# EAGLE design MiP D1 mini Pack v1 (EAGLE 7.7.0)
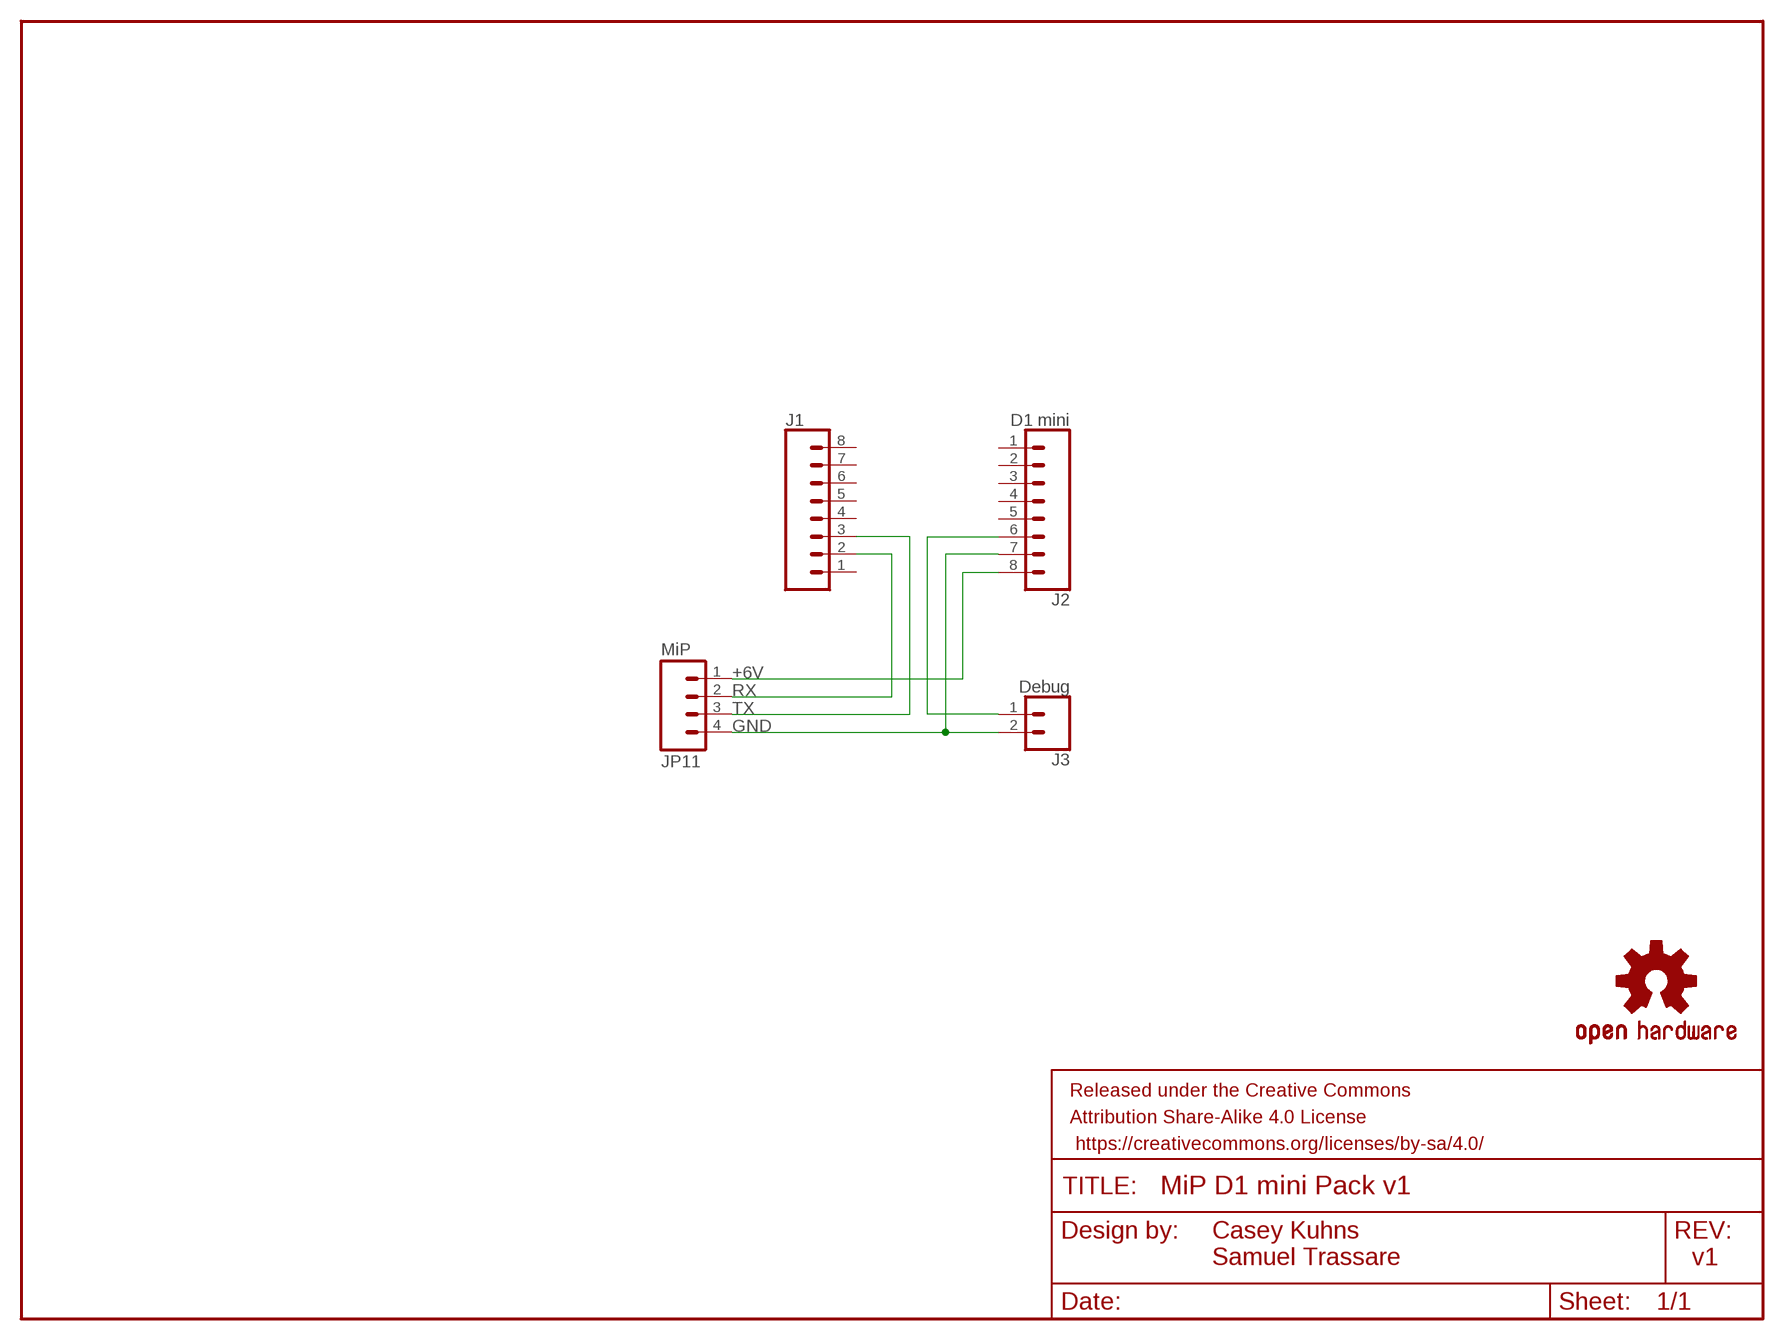
[diagram p0: schematic, sheet 1]

## Parts
FRAME1  FRAME-LETTER  [CREATIVE_COMMONS]
J1  CONN_08"  [1X08]
J2  D1 mini  CONN_08"  [1X08]
J3  Debug  CONN_02PTH_RA_FEMALE  [1X02_RA_PTH_FEMALE]
JP11  MiP  M04JST  [1X04-1.5MM_JST]
LOGO2  OSHW-LOGOS  [OSHW-LOGO-S]

## Nets
+6V [vcc]: J2.8 JP11.1
GND [ground]: J2.7 J3.2 JP11.4
N$4: J2.6 J3.1
RX: J1.2 JP11.2
TX: J1.3 JP11.3
Unconnected: J1.1 J1.4 J1.5 J1.6 J1.7 J1.8 J2.1 J2.2 J2.3 J2.4 J2.5

## Notes on the sheet
- Casey Kuhns
  Samuel Trassare
- v1

## Library data of the parts
FRAME1 = SparkFun-Aesthetics:FRAME-LETTER: Schematic Frame Standard 8.5x11 US Letter frame
J1 J2 = SparkFun-Connectors:CONN_08: Multi connection point. Often used as Generic Header-pin footprint for 0.1 inch spaced/style header connections On any of the 0.1 inch spaced packages, you can populate with these: Break Away Headers - Straight <https://www.sparkfun.com/products/116> (PRT-00116) Break Away Male Headers - Right Angle <https://www.sparkfun.com/products/553> (PRT-00553) Female Headers <https://www.sparkfun.com/products/115> (PRT-00115) Break Away Headers - Machine Pin <https://www.sparkfun.com/products/117> (PRT-00117) Break Away Female Headers - Swiss Machine Pin <https://www.sparkfun.com/products/743> (PRT-00743) Arduino Stackable Header - 8 Pin <https://www.sparkfun.com/products/9279> (PRT-09279) For SCREWTERMINALS and SPRING TERMINALS visit here: Screw Terimnals on SparkFun.com <https://www.sparkfun.com/search/results?term=Screw+Terminals> (5mm/3.5mm/2.54mm spacing) This device is also useful as a general connection point to wire up your design to another part of your project. Our various solder wires solder well into these plated through hole pads. Hook-Up Wire - Assortment (Stranded, 22 AWG) <https://www.sparkfun.com/products/11375> (PRT-11375) Hook-Up Wire - Assortment (Solid Core, 22 AWG) <https://www.sparkfun.com/products/11367> (PRT-11367) View the entire wire category on our website here <https://www.sparkfun.com/categories/141> Special notes: Molex polarized connector foot print use with SKU : PRT-08231 with associated crimp pins and housings. 1MM SMD Version SKU: PRT-10208 NOTES ON THE VARIANTS LOCK and LOCK_LONGPADS... This footprint was designed to help hold the alignment of a through-hole component (i.e. 6-pin header) while soldering it into place. You may notice that each hole has been shifted either up or down by 0.005 of an inch from it's more standard position (which is a perfectly straight line). This slight alteration caused the pins (the squares in the middle) to touch the edges of the holes. Because they are alternating, it causes a "brace" to hold the component in place. 0.005 has proven to be the perfect amount of "off-center" position when using our standard breakaway headers. Although looks a little odd when you look at the bare footprint, once you have a header in there, the alteration is very hard to notice. Also,if you push a header all the way into place, it is covered up entirely on the bottom side.; PROD_ID: CONN-08438
J3 = SparkFun-Connectors:CONN_02: Multi connection point. Often used as Generic Header-pin footprint for 0.1 inch spaced/style header connections On any of the 0.1 inch spaced packages, you can populate with these: Break Away Headers - Straight <https://www.sparkfun.com/products/116> (PRT-00116) Break Away Male Headers - Right Angle <https://www.sparkfun.com/products/553> (PRT-00553) Female Headers <https://www.sparkfun.com/products/115> (PRT-00115) Break Away Headers - Machine Pin <https://www.sparkfun.com/products/117> (PRT-00117) Break Away Female Headers - Swiss Machine Pin <https://www.sparkfun.com/products/743> (PRT-00743) For SCREWTERMINALS and SPRING TERMINALS visit here: Screw Terimnals on SparkFun.com <https://www.sparkfun.com/search/results?term=Screw+Terminals> (5mm/3.5mm/2.54mm spacing) This device is also useful as a general connection point to wire up your design to another part of your project. Our various solder wires solder well into these plated through hole pads. Hook-Up Wire - Assortment (Stranded, 22 AWG) <https://www.sparkfun.com/products/11375> (PRT-11375) Hook-Up Wire - Assortment (Solid Core, 22 AWG) <https://www.sparkfun.com/products/11367> (PRT-11367) View the entire wire category on our website here <https://www.sparkfun.com/categories/141> Special notes: Molex polarized connector foot print use with: PRT-08233 with associated crimp pins and housings. 2.54_SCREWTERM for use with PRT-10571. 3.5mm Screw Terminal footprints for PRT-08084 5mm Screw Terminal footprints for use with PRT-08432; PROD_ID: CONN-13700
JP11 = SparkFun-Connectors:M04: Header 4 Standard 4-pin 0.1" header. Use with straight break away headers (SKU : PRT-00116), right angle break away headers (PRT-00553), swiss pins (PRT-00743), machine pins (PRT-00117), and female headers (PRT-00115). Molex polarized connector foot print use with SKU : PRT-08231 with associated crimp pins and housings. 1MM SMD Version SKU: PRT-10208
LOGO2 = SparkFun-Aesthetics:OSHW-LOGO: Open Source Hardware Logo This logo indicates the piece of hardware it is found on incorporates a OSHW license and/or adheres to the definition of open source hardware found here: http://freedomdefined.org/OSHW

## Net classes
0 default: width 0.406 mm
1 vcc: width 0.61 mm
2 ground: width 0.61 mm

## Board
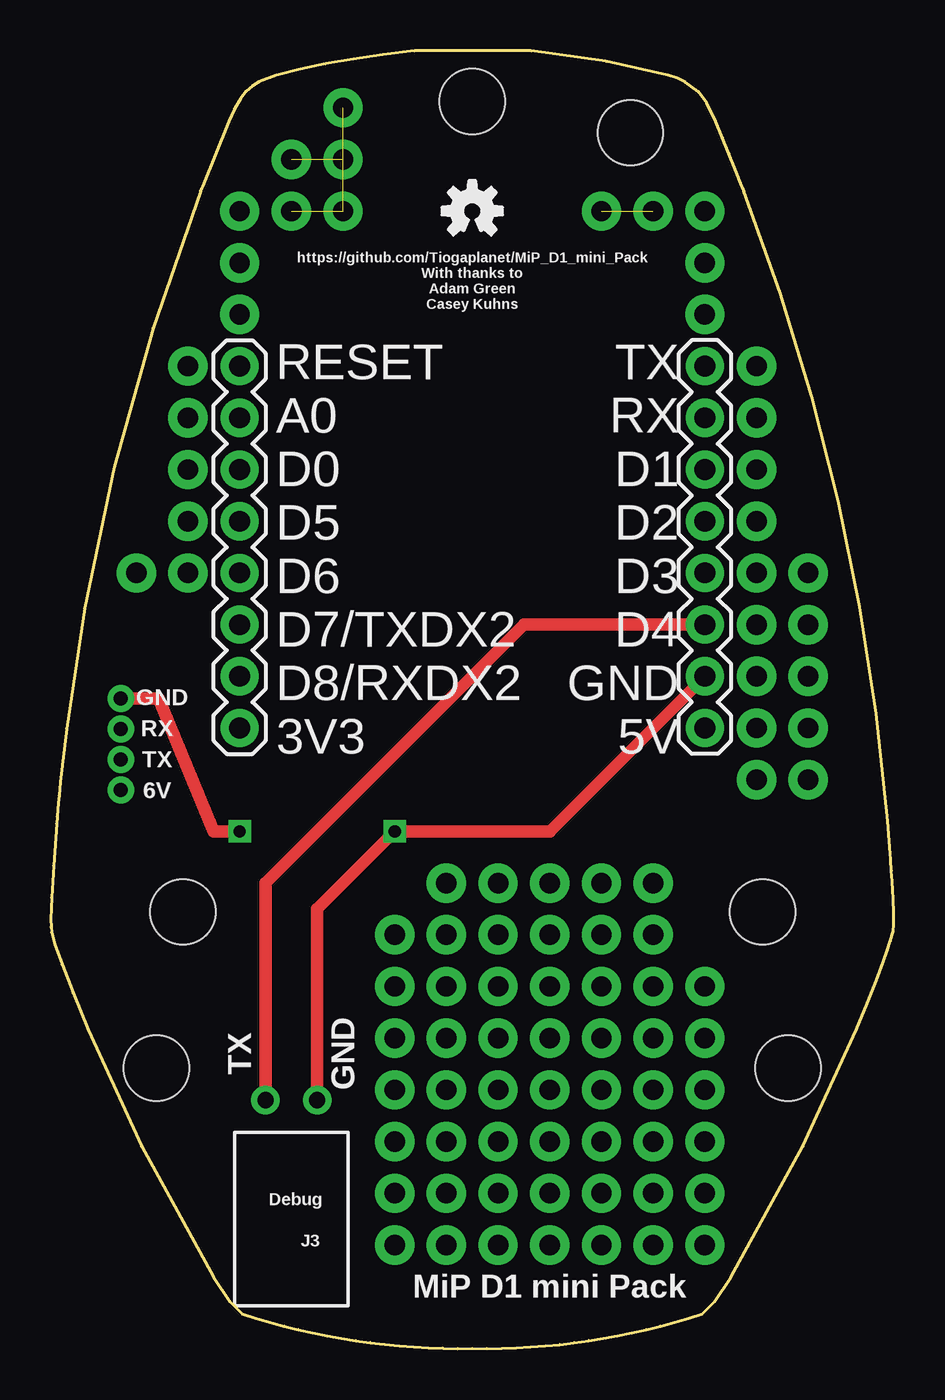
[diagram p1: board, top side]
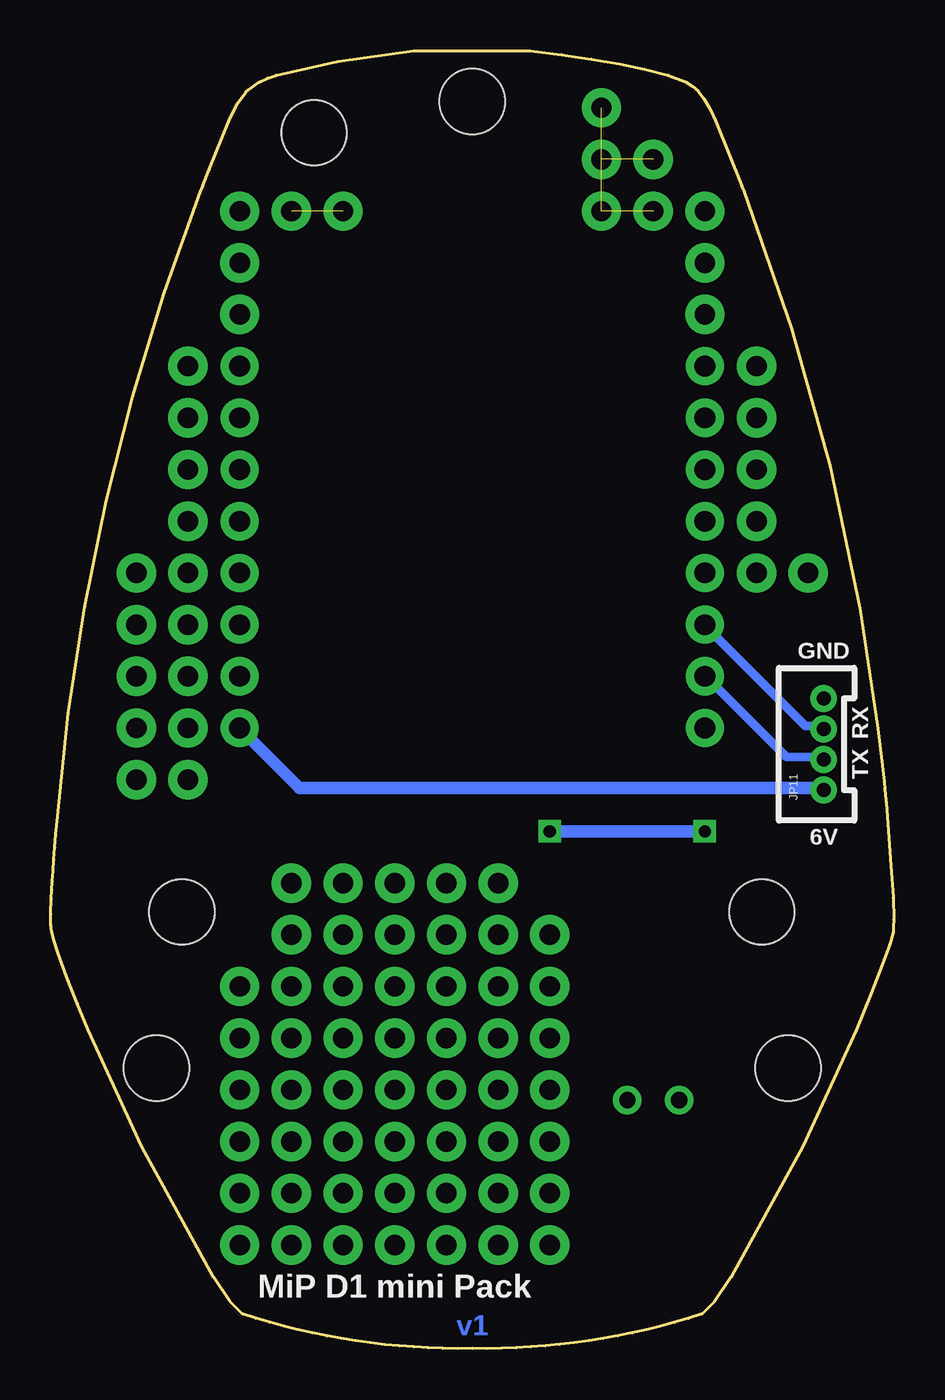
[diagram p2: board, bottom side, seen from below]

Size 41.42 x 63.77 mm. Coordinates in mm from the lower left corner, seen from the top.
Outline: 16.32,63.59 14.86,63.37 13.5,63.13 12.25,62.87 11.09,62.58 10.24,62.25 9.89,62.03 9.6,61.78 9.32,61.43 9.03,60.94 8.74,60.3 7.46,57.12 7.46,57.1 7.45,57.09 7.44,57.07 7.44,57.06 7.43,57.04 7.42,57.03 7.42,57.01 7.41,57 7.4,56.98 7.4,56.97 7.39,56.96 7.38,56.94 7.37,56.93 7.36,56.91 7.36,56.9 7.35,56.88 5.02,50.15 3.12,43.32 1.66,36.38 0.77,30.47 0.47,27.85 0.44,27.51 0.4,27.17 0.37,26.82 0.31,26.14 0.28,25.79 0.13,23.74 0.03,22.17 0,21.08 0.01,20.71 0.03,20.47 0.2,19.87 0.55,18.87 1.09,17.47 1.83,15.67 4.46,9.93 8.01,3.51 8.82,2.29 9.4,1.71 10.08,1.49 10.77,1.29 11.47,1.1 12.16,0.93 12.86,0.77 13.57,0.63 14.27,0.5 14.98,0.39 15.69,0.29 16.41,0.21 17.12,0.14 17.84,0.08 18.56,0.04 19.27,0.02 19.99,0 20.71,0.01 21.43,0 22.15,0.01 22.86,0.04 23.58,0.08 24.3,0.13 25.01,0.2 25.72,0.29 26.44,0.39 27.15,0.5 27.85,0.63 28.56,0.77 29.26,0.93 29.95,1.1 30.65,1.29 31.34,1.49 32.02,1.71 32.6,2.29 33.41,3.51 36.96,9.93 39.59,15.67 40.12,16.97 40.56,18.08 40.91,19 41.11,19.57 41.26,20.03 41.39,20.5 41.42,20.84 41.42,21.36 41.4,22.11 41.37,22.52 41.35,22.98 41.31,23.48 41.27,24.03 41.23,24.62 41.18,25.26 41.12,25.94 40.56,31.21 39.75,36.45 38.69,41.65 37.39,46.79 35.85,51.87 34.07,56.88 34.06,56.9 34.05,56.91 34.05,56.93 34.04,56.94 34.03,56.96 34.02,56.97 34.02,56.98 34.01,57 34,57.01 33.99,57.03 33.99,57.04 33.98,57.06 33.98,57.07 33.97,57.09 33.96,57.1 33.96,57.12 33.64,57.92 33.33,58.72 33.01,59.51 32.68,60.3 32.24,61.2 31.83,61.77 31.18,62.24 30.78,62.43 30.33,62.58 27.28,63.25 23.6,63.77 17.87,63.77 16.32,63.59
Copper layers (1*16): Top 0.035mm / dielectric 1.5mm / Bottom 0.035mm
Design rules "SparkFun": minimum track width 8mil, minimum drill 20mil, track to track 8mil, track to pad 8mil, pad to pad 8mil, via to via 8mil, smd to smd 8mil, copper to edge 10mil, drill to drill 8mil, minimum pad ring 12mil, minimum via ring 10mil, stop-mask expansion 4mil, vias tented up to drill 25mil, thermal gap 10mil
Holes 3.2 mm at 20.71,61.28 28.48,59.76 34.98,21.45 5.19,13.78 36.23,13.78 6.49,21.45

### Footprints (pad centres in the part's own frame; a part is rotated, then mirrored left to right if it is on the bottom)
1X08 = drill 1.016 pad 1.88: 1 0,0; 2 2.54,0; 3 5.08,0; 4 7.62,0; 5 10.16,0; 6 12.7,0; 7 15.24,0; 8 17.78,0
1X02_RA_PTH_FEMALE = drill 0.8: 1 1.27,-5.85; 2 -1.27,-5.85
1X04-1.5MM_JST = drill 0.7: 1 0,0; 2 1.5,0; 3 3,0; 4 4.5,0

### Placement (x,y rotation side)
FRAME1  -14.85,-11.41 0 top  (outside the outline)
J1  9.28,30.5 90 top
J2  32.14,48.28 270 top
J3  11.82,6.37 180 top
JP11  3.44,27.45 90 bottom
LOGO2  20.71,55.9 0 top

### Tracks (layer width: path | path; a pad name or v marks a point on that pad's centre or on a via)
+6V
  Bottom 0.61: J2.8 29.19,27.55 3.44,27.55 JP11.1
GND  (via drill 0.6)
  Top 0.61: JP11.4 5.29,31.95 8.01,25.42 v9.28,25.42 | J2.7 24.52,25.42 v16.9,25.42 13.09,21.61 J3.2
  Bottom 0.61: v9.28,25.42 v16.9,25.42
N$2  (via drill 1 pad 1.93)
  other vias: 16.9,7.64
N$3  (via drill 1 pad 1.93)
  other vias: 16.9,12.72
N$4
  Top 0.61: J3.1 10.55,22.88 23.25,35.58 J2.6
N$5  (via drill 1 pad 1.93)
  other vias: 21.98,10.18
N$6  (via drill 1 pad 1.93)
  other vias: 21.98,5.1
N$7  (via drill 1 pad 1.93)
  other vias: 27.06,10.18
N$8  (via drill 1 pad 1.93)
  other vias: 16.9,15.26
N$9  (via drill 1 pad 1.93)
  other vias: 16.9,17.8
N$10  (via drill 1 pad 1.93)
  other vias: 16.9,5.1
N$11  (via drill 1 pad 1.93)
  other vias: 16.9,20.34
N$12  (via drill 1 pad 1.93)
  other vias: 16.9,10.18
N$13  (via drill 1 pad 1.93)
  other vias: 29.6,17.8
N$16  (via drill 1 pad 1.93)
  other vias: 29.6,10.18
N$20  (via drill 1 pad 1.93)
  other vias: 27.06,12.72
N$21  (via drill 1 pad 1.93)
  other vias: 27.06,15.26
N$23  (via drill 1 pad 1.93)
  other vias: 27.06,17.8
N$27  (via drill 1 pad 1.93)
  other vias: 4.2,38.12
N$29  (via drill 1 pad 1.93)
  other vias: 32.14,17.8
N$30  (via drill 1 pad 1.93)
  other vias: 21.98,22.88 19.44,22.88
N$31  (via drill 1 pad 1.93)
  other vias: 37.22,30.5
N$32  (via drill 1 pad 1.93)
  other vias: 29.6,7.64
N$34  (via drill 1 pad 1.93)
  other vias: 27.06,20.34
N$35  (via drill 1 pad 1.93)
  other vias: 32.14,12.72
N$40  (via drill 1 pad 1.93)
  other vias: 34.68,45.74
N$43  (via drill 1 pad 1.93)
  other vias: 19.44,7.64
N$45  (via drill 1 pad 1.93)
  other vias: 24.52,22.88
N$46  (via drill 1 pad 1.93)
  other vias: 37.22,27.96
N$47  (via drill 1 pad 1.93)
  other vias: 32.14,5.1
N$48  (via drill 1 pad 1.93)
  other vias: 24.52,5.1
N$50  (via drill 1 pad 1.93)
  other vias: 34.68,43.2
N$53  (via drill 1 pad 1.93)
  other vias: 34.68,40.66
N$55  (via drill 1 pad 1.93)
  other vias: 19.44,12.72
N$56  (via drill 1 pad 1.93)
  other vias: 19.44,15.26
N$57  (via drill 1 pad 1.93)
  other vias: 32.14,7.64
N$58  (via drill 1 pad 1.93)
  other vias: 21.98,15.26
N$59  (via drill 1 pad 1.93)
  other vias: 19.44,17.8
N$72  (via drill 1 pad 1.93)
  other vias: 21.98,17.8
N$73  (via drill 1 pad 1.93)
  other vias: 24.52,15.26
N$78  (via drill 1 pad 1.93)
  other vias: 24.52,17.8
N$81  (via drill 1 pad 1.93)
  other vias: 29.6,5.1
N$89  (via drill 1 pad 1.93)
  other vias: 19.44,5.1
N$92  (via drill 1 pad 1.93)
  other vias: 27.06,7.64
N$93  (via drill 1 pad 1.93)
  other vias: 6.74,40.66
N$94  (via drill 1 pad 1.93)
  other vias: 6.74,43.2
N$95  (via drill 1 pad 1.93)
  other vias: 6.74,48.28
N$96  (via drill 1 pad 1.93)
  other vias: 21.98,20.34 19.44,20.34
N$98  (via drill 1 pad 1.93)
  other vias: 6.74,38.12
N$102  (via drill 1 pad 1.93)
  other vias: 24.52,7.64
N$103  (via drill 1 pad 1.93)
  other vias: 21.98,7.64
N$104  (via drill 1 pad 1.93)
  other vias: 27.06,5.1
N$117  (via drill 1 pad 1.93)
  other vias: 24.52,20.34
N$118  (via drill 1 pad 1.93)
  other vias: 32.14,10.18
N$120  (via drill 1 pad 1.93)
  other vias: 32.14,15.26
N$121  (via drill 1 pad 1.93)
  other vias: 34.68,27.96
N$122  (via drill 1 pad 1.93)
  other vias: 29.6,20.34
N$124  (via drill 1 pad 1.93)
  other vias: 32.14,53.36
N$125  (via drill 1 pad 1.93)
  other vias: 24.52,12.72
N$127  (via drill 1 pad 1.93)
  other vias: 29.6,15.26
N$128  (via drill 1 pad 1.93)
  other vias: 29.6,12.72
N$129  (via drill 1 pad 1.93)
  other vias: 21.98,12.72
N$131  (via drill 1 pad 1.93)
  other vias: 24.52,10.18
N$165  (via drill 1 pad 1.93)
  other vias: 34.68,48.28
N$177  (via drill 1 pad 1.93)
  other vias: 34.68,30.5
N$178  (via drill 1 pad 1.93)
  other vias: 34.68,35.58
N$180  (via drill 1 pad 1.93)
  other vias: 19.44,10.18
N$188  (via drill 1 pad 1.93)
  other vias: 6.74,45.74
N$191  (via drill 1 pad 1.93)
  other vias: 9.28,50.82
N$199  (via drill 1 pad 1.93)
  other vias: 34.68,33.04
N$201  (via drill 1 pad 1.93)
  other vias: 37.22,33.04
N$202  (via drill 1 pad 1.93)
  other vias: 29.6,22.88
N$203  (via drill 1 pad 1.93)
  other vias: 37.22,35.58
N$204  (via drill 1 pad 1.93)
  other vias: 9.28,53.36
N$205  (via drill 1 pad 1.93)
  other vias: 27.06,22.88
N$213  (via drill 1 pad 1.93)
  other vias: 32.14,50.82
N$234  (via drill 1 pad 1.93)
  other vias: 34.68,38.12
N$235  (via drill 1 pad 1.93)
  other vias: 37.22,38.12
N$236  (via drill 1 pad 1.93)
  other vias: 9.28,55.9
N$239  (via drill 1 pad 1.93)  (4 unrouted)
  other vias: 11.82,55.9 14.36,55.9 14.36,58.44 11.82,58.44 14.36,60.98
N$249  (via drill 1 pad 1.93)  (1 unrouted)
  other vias: 29.6,55.9 27.06,55.9
N$250  (via drill 1 pad 1.93)
  other vias: 32.14,55.9
RX
  Bottom 0.406: JP11.2 3.44,29.07 5.27,29.07 9.23,33.04 J1.2
TX
  Bottom 0.406: JP11.3 3.44,30.6 4.35,30.6 9.23,35.47 J1.3

### Text on the board
Bottom: v1
tPlace: https://github.com/Tiogaplanet/MiP_D1_mini_Pack / With thanks to / Adam Green / Casey Kuhns | GND | RX | TX | RESET / A0 / D0 / D5 / D6 / D7/TXDX2 / D8/RXDX2 / 3V3 | TX / RX / D1 / D2 / D3 / D4 / GND / 5V | 6V | TX | GND | MiP D1 mini Pack
bPlace: GND | RX | TX | 6V | MiP D1 mini Pack
tDocu: Casey Kuhns, Samuel Trassare